# Altium schematic sheet llrf_afe_mfm_rio.SchDoc: =GlobalProjectName
size 209 x 297 mm; SheetNumber: 15; SheetTotal: 17; PageSetup: Record=PageOptions|CenterHorizontal=True|CenterVertical=True|PrintScale=1.00|XCorrection=1.00|YCorrection=1.00|PrintKind=1|BorderSize=5000000|LeftOffset=0|BottomOffset=0|Orientation=2|PaperLength=1000|PaperWidth=1000|Scale=100|PaperSource=15|PrintQuality=1200|MediaType=1|DitherType=10|PaperKind=A3|PrintScaleMode=1; Weight: -; ScaleFactor: -
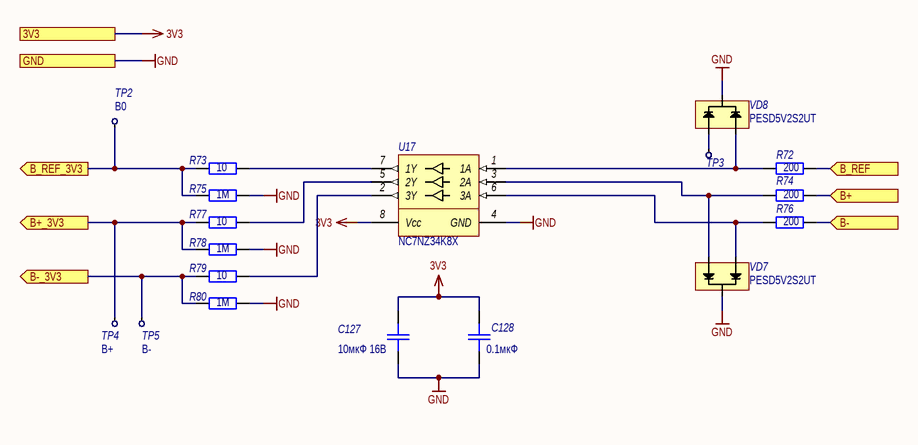
[diagram p0: llrf_afe_mfm_rio.SchDoc]

## Parts
C127  10мкФ 16В  [SMD_C0603]
C128  0.1мкФ  [SMD_C0402]
R72  200  [SMD_0603]
R73  10  [SMD_0603]
R74  200  [SMD_0603]
R75  1M  [SMD_0603]
R76  200  [SMD_0603]
R77  10  [SMD_0603]
R78  1M  [SMD_0603]
R79  10  [SMD_0603]
R80  1M  [SMD_0603]
TP2  B0  [TestPoint]
TP3  (no value)  [TestPoint]
TP4  B+  [TestPoint]
TP5  B-  [TestPoint]
U17  Наименование: NC7NZ34K8X  [US-8]  (hidden comment: NC7NZ34)
VD7  Наименование: PESD5V2S2UT  [SOT-23]  (hidden comment: PESDxS2UT)
VD8  Наименование: PESD5V2S2UT  [SOT-23]  (hidden comment: PESDxS2UT)

## Ports
3V3, B+ (in), B+_3V3 (out), B- (in), B-_3V3 (out), B_REF (in), B_REF_3V3 (out), GND

## Nets
3V3: C127.2 C128.2 U17.8(Vcc) ; port 3V3
GND: C127.1 C128.1 R75.1 R78.1 R80.1 U17.4(GND) VD7.3(C3) VD8.3(C3) ; port GND
B+: R74.2 ; port B+
B+_3V3: R77.1 R78.2 TP4.0(TP) ; port B+_3V3
B-: R76.2 ; port B-
B-_3V3: R79.1 R80.2 TP5.0(TP) ; port B-_3V3
B_REF: R72.2 ; port B_REF
B_REF_3V3: R73.1 R75.2 TP2.0(TP) ; port B_REF_3V3
NetR72_1: R72.1 U17.1(1A) VD8.1(C1)
NetR73_2: R73.2 U17.7(1Y)
NetR74_1: R74.1 U17.3(2A) VD7.1(C1)
NetR76_1: R76.1 U17.6(3A) VD7.2(C2)
NetR77_2: R77.2 U17.5(2Y)
NetR79_2: R79.2 U17.2(3Y)
NetTP3_0: TP3.0(TP) VD8.2(C2)

## Notes on the sheet
- Подп. и дата
- Инв. № дубл.
- Взам. инв. №
- Инв. № подл.
- Изм.
- Лист
- № докум.
- Подп.
- Дата
- Форма 2а ГОСТ 2.104-2006
- Копировал
- Формат А4

## Library data of the parts
C127 = Capacitor: Назначение: SMD-конденсатор; Наименование: GRM188C81C106MA73; Потребление, Вт: 0; Value: 10мкФ 16В
C128 = Capacitor: Назначение: SMD-конденсатор; Наименование: Конденсатор; Потребление, Вт: 0; Value: 0.1мкФ
R72-R80 = Resistor: Наименование: Резистор; Назначение: SMD-резистор; Потребление, Вт: 0,001
  R72 R74 R76: Value: 200
  R73 R77 R79: Value: 10
  R75 R78 R80: Value: 1M
TP2-TP5 = TP: Наименование: Точка проверки; Назначение: Контроль параметров платы
  TP2: TP_Name: B0
  TP4: TP_Name: B+
  TP5: TP_Name: B-
U17 = NC7NZ34: TinyLogic UHS Triple Buffer; Потребление, Вт: 0.01; Назначение: TinyLogic UHS Triple Buffer; ComponentLink1Description: DataSheet; ComponentLink1URL: https://www.onsemi.com/pdf/datasheet/nc7nz34-d.pdf; Supplier 1: Digi-Key; Supplier Part Number 1: NC7NZ34K8XCT-ND
VD7 VD8 = PESDxS2UT: Double ESD protection diodes; Потребление, Вт: 0; Назначение: Double ESD protection diodes; ComponentLink1Description: DataSheet; ComponentLink1URL: https://assets.nexperia.com/documents/data-sheet/PESDXS2UT_SERIES.pdf